# EasyEDA Pro project ProDoc_眼部光源板.epro

# Schematic Schematic4
Board Name: 红外补光灯-眼部4; Create Date: 2026-01-05; Page Name: P1; Project Name: FAICAL TRACKER VR模块; Schematic Name: Schematic3_3; Update Date: 2026-01-06; BladeWidth: 10; Company: 嘉立创EDA; Page Size: A4; RegionStart: 1; ShowBorder: 1; TitleBlock: 1; TitleBlockPosition: 3; Version: V1.0; XRegionCount: 6; YRegionCount: 4
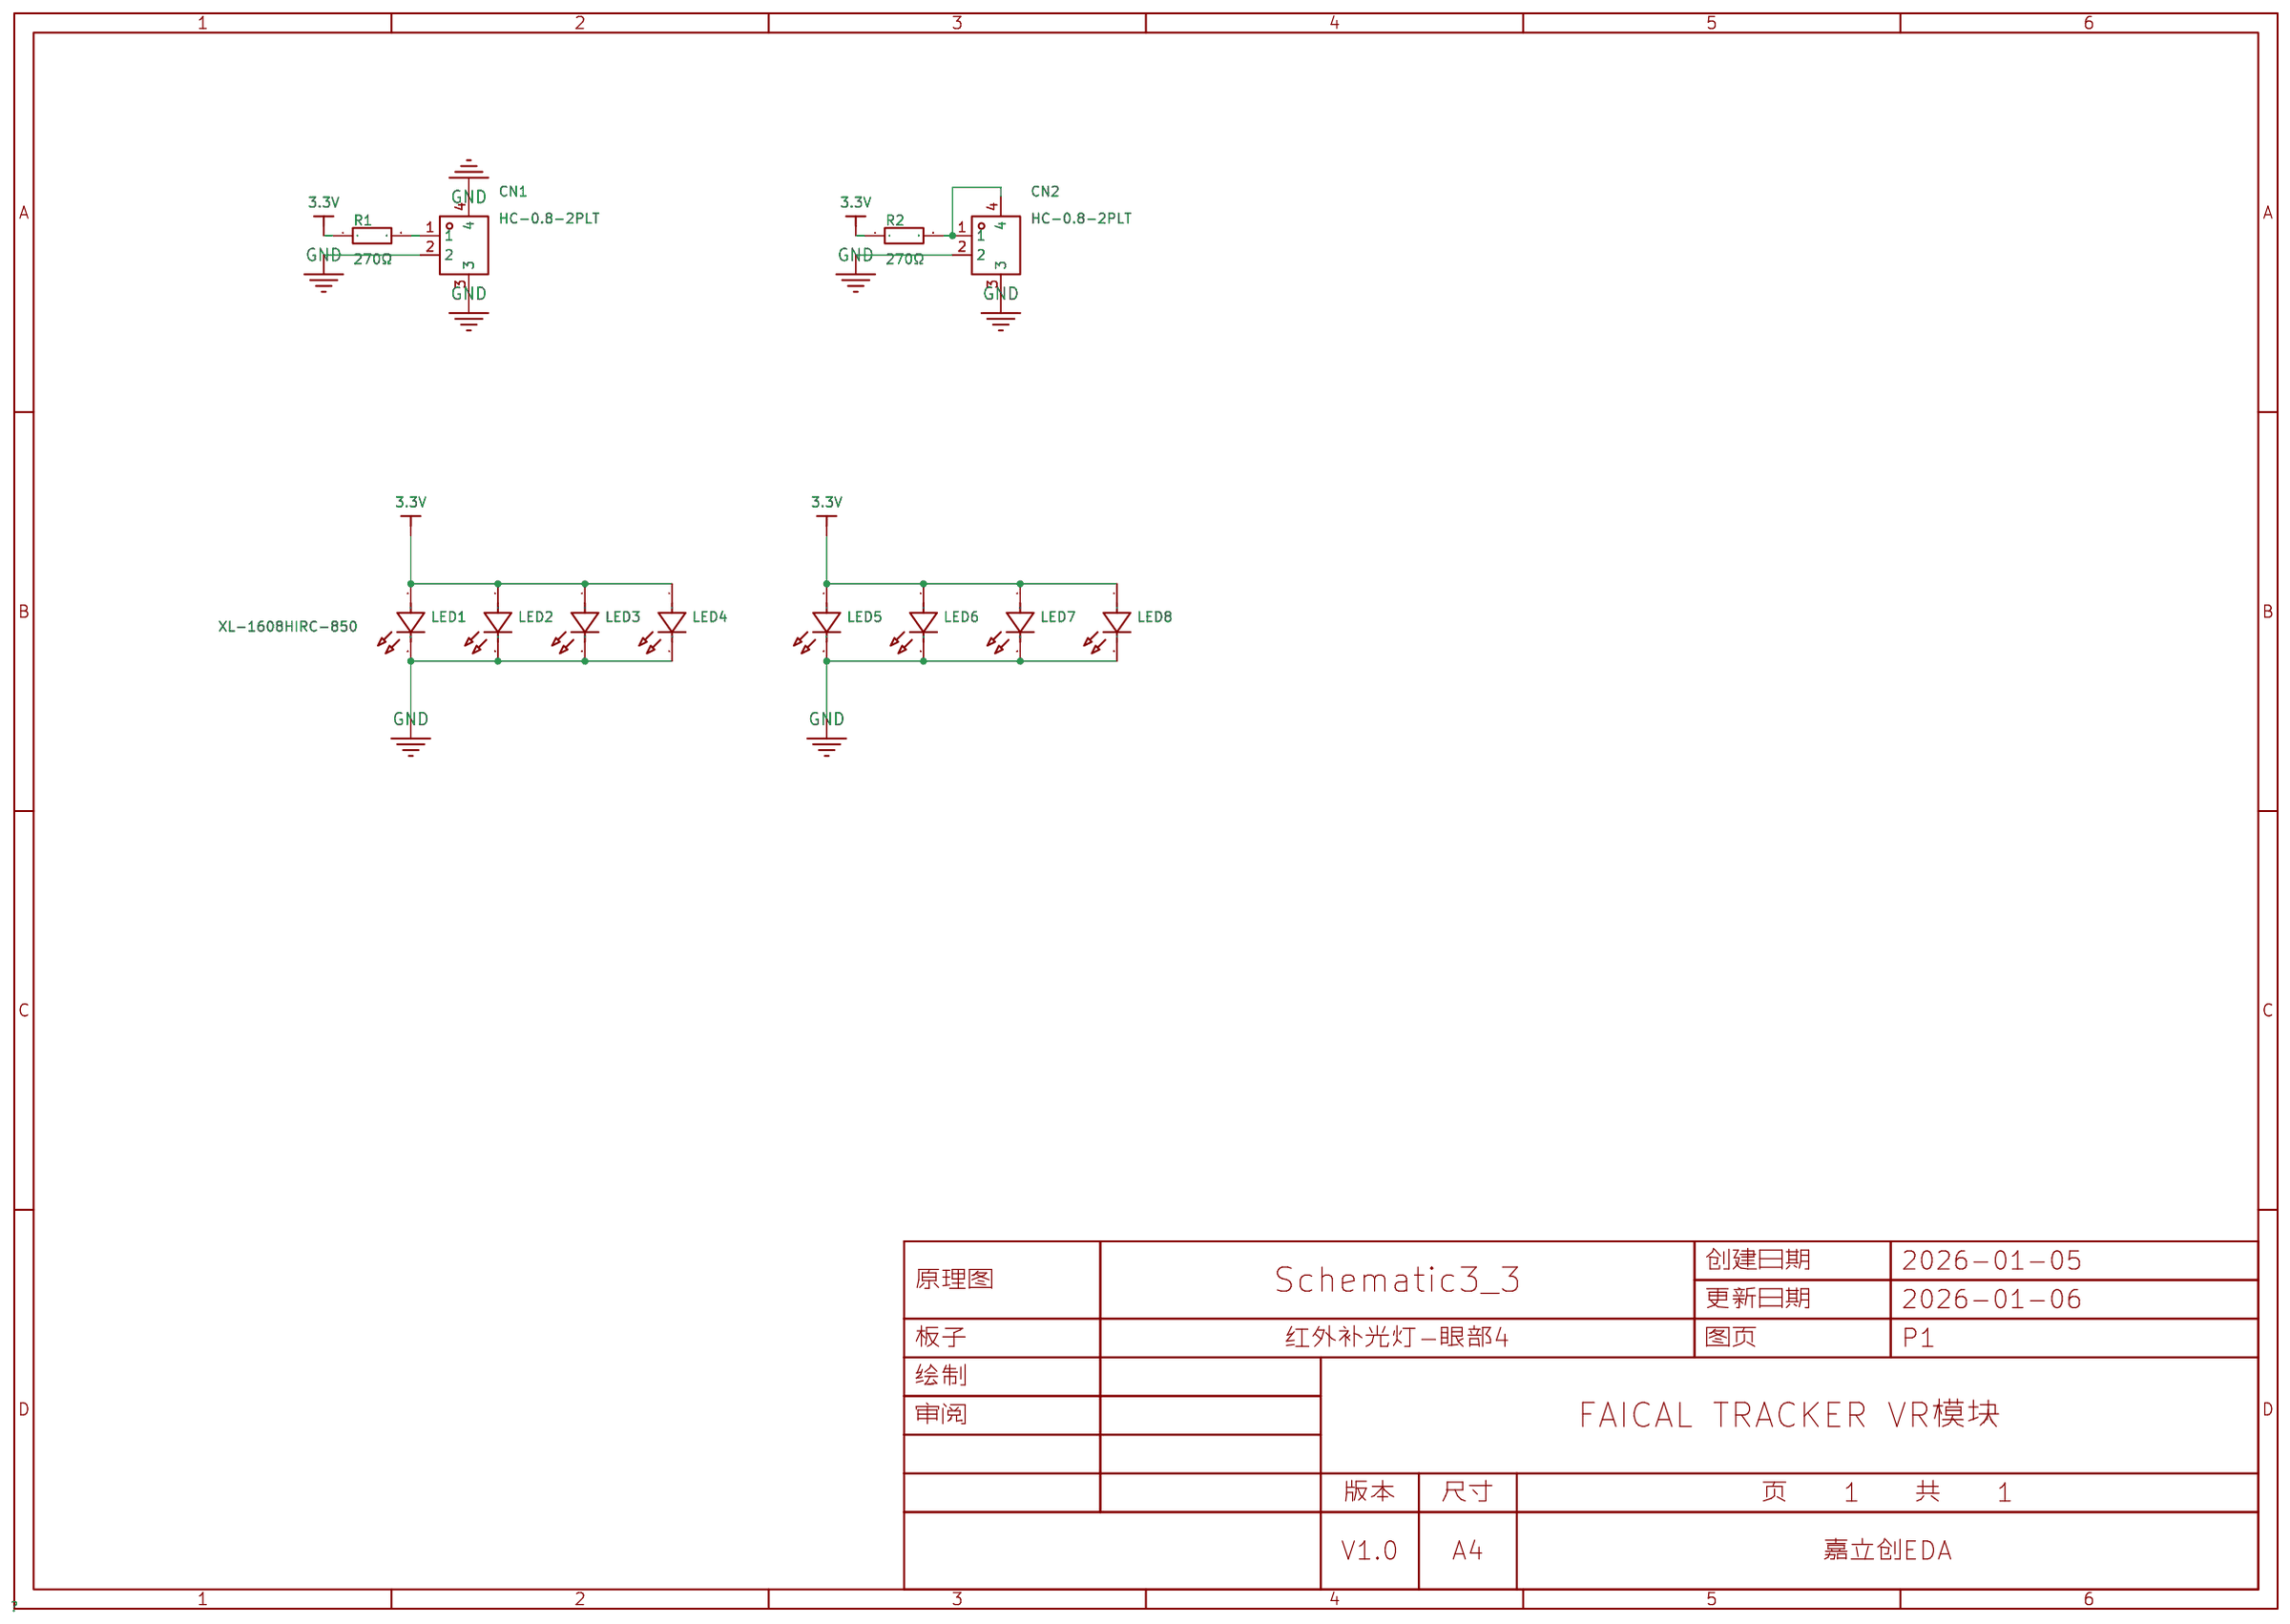
[diagram p0: schematic sheet]

## Parts
CN1  HC-0.8-2PLT  [CONN-SMD_2P-P0.80_HCTL_HC-0.8-2PLT]
CN2  HC-0.8-2PLT  [CONN-SMD_2P-P0.80_HCTL_HC-0.8-2PLT]
LED1  XL-1608HIRC-850  [OPTO-SMD_L1.6-W0.80-RD_XL-1608HIRC-850]
LED2  XL-1608HIRC-850  [OPTO-SMD_L1.6-W0.80-RD_XL-1608HIRC-850]
LED3  XL-1608HIRC-850  [OPTO-SMD_L1.6-W0.80-RD_XL-1608HIRC-850]
LED4  XL-1608HIRC-850  [OPTO-SMD_L1.6-W0.80-RD_XL-1608HIRC-850]
LED5  XL-1608HIRC-850  [OPTO-SMD_L1.6-W0.80-RD_XL-1608HIRC-850]
LED6  XL-1608HIRC-850  [OPTO-SMD_L1.6-W0.80-RD_XL-1608HIRC-850]
LED7  XL-1608HIRC-850  [OPTO-SMD_L1.6-W0.80-RD_XL-1608HIRC-850]
LED8  XL-1608HIRC-850  [OPTO-SMD_L1.6-W0.80-RD_XL-1608HIRC-850]
R1  270Ω  [R0603]
R2  270Ω  [R0603]

## Library data of the parts
CN1 CN2 = HC-0.8-2PLT: 插针结构:1x2P;间距:0.8mm;安装方式:立贴;参考系列:-;总PIN数:2P;排数:1;每排PIN数:2;行距:-;额定电流:500mA;触头材质:磷青铜;触头镀层:锡;工作温度范围:-25℃~+85℃;; LCSC Part Name: 1x2P 间距:0.8mm 立贴; Supplier Part: C2845352; Manufacturer: HCTL(华灿天禄); Supplier Footprint: SMD,P=0.8mm; JLCPCB Part Class: 扩展库; Datasheet: https://atta.szlcsc.com/upload/public/pdf/source/20230707/E6027C9B14B825F412DA71DD45B27639.pdf; Supplier: LCSC; Pins Structure: 1x2P; Pitch: 0.8mm; Mounting Style: 立贴; Number of Pins: 2P; Number of Rows: 1; Number of PINs Per Row: 2; Current Rating (Max): 500mA; Contact Material: 磷青铜; Contact Plating: 锡; Operating Temperature Range: -25℃~+85℃; Rated Voltage (Max): 30V; Plastic Material: LCP; Flame Retardant Rating: UL94V-0; Supplementary Features: 辅助焊脚; Z-Height of the Board: 2.8mm; X-Length of Bottom Edge on Board (Spacing Line): 3.8mm; Y-Width of Bottom Edge on Board: 2.15mm
LED1-LED8 = XL-1608HIRC-850: 正向电压:1.3V~1.7V;耗散功率:70mW;波长:850nm~860nm;辐射强度:-;正向电流-DC (If):30mA;直流反向耐压:5V;视角:120°;; LCSC Part Name: 850nm 30mA红外发射; Supplier Part: C965885; Manufacturer: XINGLIGHT(成兴光); Supplier Footprint: 0603; JLCPCB Part Class: Extended Part; Datasheet: https://atta.szlcsc.com/upload/public/pdf/source/20221102/BD31B8549814085368CE28C247371275.pdf; Supplier: LCSC; Vf - Forward Voltage: 1.3V~1.7V; Power Dissipation: 70mW; Wavelength: 850nm~860nm; Current - DC Forward (If): 30mA; Reverse Voltage: 5V; View Angle: 120°; Operating Temperature: -30℃~+85℃
R1 R2 = 0603WAF2700T5E: 电阻类型:厚膜电阻;阻值:270Ω;精度:±1%;功率:100mW;工作电压:75V;温度系数:±100ppm/℃;; LCSC Part Name: 270Ω ±1% 100mW 厚膜电阻; Supplier Part: C22966; Manufacturer: UNI-ROYAL(厚声); Supplier Footprint: 0603; JLCPCB Part Class: Basic Part; Datasheet: https://item.szlcsc.com/datasheet/0603WAF2700T5E/23693.html; Supplier: LCSC; Type: 厚膜电阻; Tolerance: ±1%; Power(Watts): 100mW; Voltage-Supply(Max): 75V; Temperature Coefficient: ±100ppm/℃; Operating Temperature: -55℃~+155℃

## Nets
3.3V: LED1.1(A) LED2.1(A) LED3.1(A) LED4.1(A) LED5.1(A) LED6.1(A) LED7.1(A) LED8.1(A) R1.1 R2.1
GND: CN1.2 CN1.3 CN1.4 CN2.2 CN2.3 LED1.2(C) LED2.2(C) LED3.2(C) LED4.2(C) LED5.2(C) LED6.2(C) LED7.2(C) LED8.2(C)
$1N2966: CN1.1 R1.2
$1N6073: CN2.1 CN2.4 R2.2

# Board PCB4
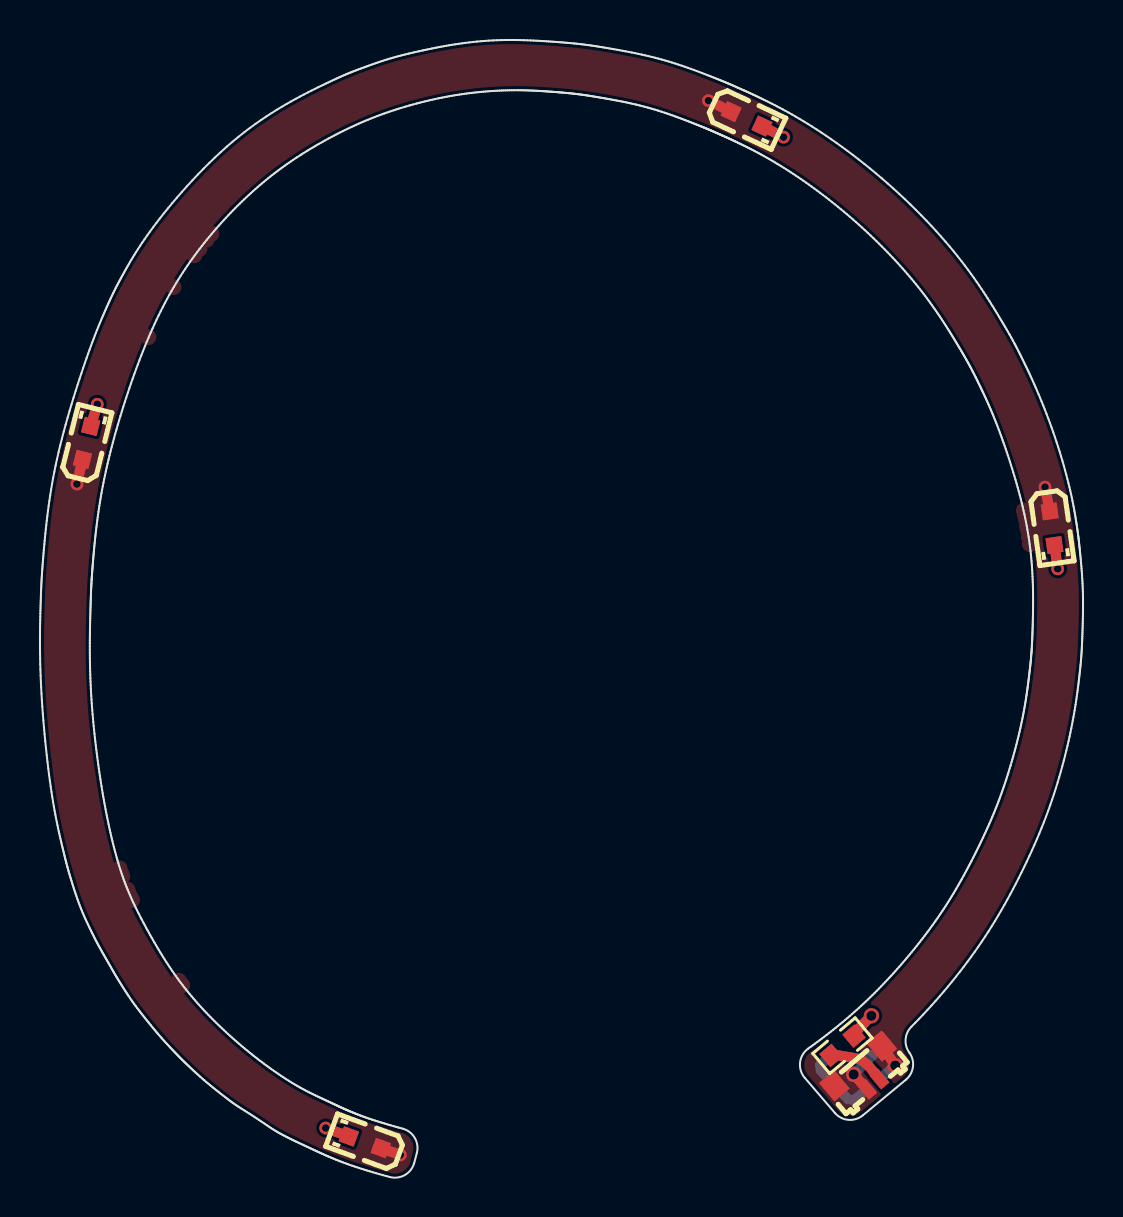
[diagram p1: board, top side]
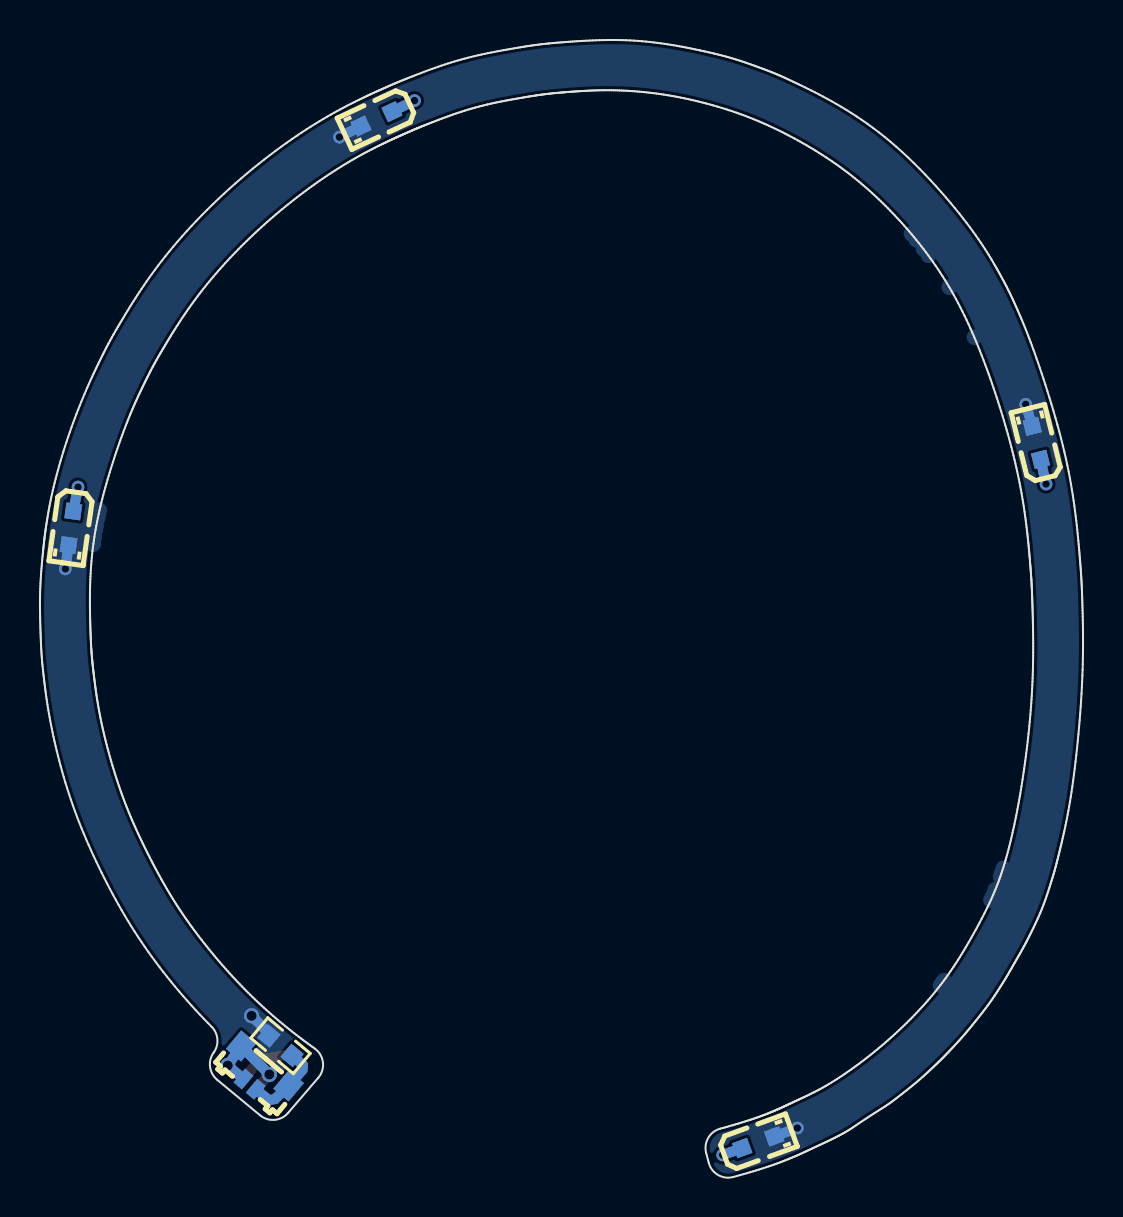
[diagram p2: board, bottom side, seen from below]

Outline 52.19 x 56.86 mm; copper layers: Top Layer, Bottom Layer. Coordinates in mm from the lower left corner of the outline.
Stack: Top Layer 0.035mm / SUBSTRATE1 0.71mm FR4 er 4.5 / Bottom Layer 0.035mm

## Design rules (mm)
spacing copperThickness1oz (default): track to track 0.152, other pairs 0.152 to 0.3
spacing copperThickness2oz: track to track 0.203, other pairs 0.152 to 0.3
spacing Plane_innerPlane: track to track 0.152, other pairs 0.152 to 0.3
spacing Copper_copperRegion: track to track 0.152, other pairs 0.152 to 0.3
spacing Copper_copperRegion1: track to track 0.152, other pairs 0.152 to 0.3
track width copperThickness1oz (default): min 0.127, default 0.254, max 2.54
track width copperThickness2oz: min 0.203, default 0.254, max 2.54
differential pair differentialPair (default): width min 0.127, default 0.254, max 2.54; gap min 0.152, default 0.152
differential pair USB-90Ω: width min 0.157, default 0.157, max 0.157; gap min 0.203, default 0.203
net GND uses copperRegion1_copperThickness1oz
pour e64 uses Copper_copperRegion, copperRegion1_Copper_copperRegion
pour e61 uses Copper_copperRegion1, copperRegion1_Copper_copperRegion1

## Placement (name value [footprint] x y rotation side)
CN1  HC-0.8-2PLT  [CONN-SMD_2P-P0.80_HCTL_HC-0.8-2PLT]  41.35 5.07 220 top
CN2  HC-0.8-2PLT  [CONN-SMD_2P-P0.80_HCTL_HC-0.8-2PLT#2]  41.35 5.07 40 bottom
LED1  XL-1608HIRC-850  [OPTO-SMD_L1.6-W0.80-RD_XL-1608HIRC-850]  2.33 36.71 76 top
LED2  XL-1608HIRC-850  [OPTO-SMD_L1.6-W0.80-RD_XL-1608HIRC-850]  16.25 1.74 160 top
LED3  XL-1608HIRC-850  [OPTO-SMD_L1.6-W0.80-RD_XL-1608HIRC-850]  35.35 52.92 335 top
LED4  XL-1608HIRC-850  [OPTO-SMD_L1.6-W0.80-RD_XL-1608HIRC-850]  50.64 32.45 278 top
LED5  XL-1608HIRC-850  [OPTO-SMD_L1.6-W0.80-RD_XL-1608HIRC-850]  16.25 1.74 160 bottom
LED6  XL-1608HIRC-850  [OPTO-SMD_L1.6-W0.80-RD_XL-1608HIRC-850]  2.33 36.71 76 bottom
LED7  XL-1608HIRC-850  [OPTO-SMD_L1.6-W0.80-RD_XL-1608HIRC-850]  35.35 52.92 335 bottom
LED8  XL-1608HIRC-850  [OPTO-SMD_L1.6-W0.80-RD_XL-1608HIRC-850]  50.64 32.45 278 bottom
R1  270Ω  [R0603]  40.15 6.56 220 top
R2  270Ω  [R0603]  40.15 6.56 220 bottom

## Footprints (pads in the part's own frame, mm; a bottom-side part is the same pattern mirrored in y, then rotated)
CONN-SMD_2P-P0.80_HCTL_HC-0.8-2PLT
  rect 0.55x0.9 smd: 1(-0.4,0.55) 2(0.4,0.55)
  rect 1x1.2 smd: 3(1.55,-0.64) 4(-1.55,-0.64)
CONN-SMD_2P-P0.80_HCTL_HC-0.8-2PLT#2
  rect 0.55x0.9 smd: 1(-0.4,0.55) 2(0.4,0.55)
  rect 1x1.2 smd: 3(1.55,-0.64) 4(-1.55,-0.64)
OPTO-SMD_L1.6-W0.80-RD_XL-1608HIRC-850
  rect 0.8x0.8 smd: 1(0.851,0) 2(-0.851,0)
R0603
  rect 0.806x0.864 smd: 1(-0.753,0) 2(0.753,0)

## Nets
As in the schematic.

## Via types
v1: diameter 0.635, hole 0.381, Top Layer to Bottom Layer, 8 vias
v2: diameter 0.762, hole 0.508, Top Layer to Bottom Layer, 3 vias

## Routing (per net, layer and track width the routed paths; a pad name or vN(x,y) marks a point on that pad's centre or on a via; arc(x,y) is an arc through that point)
3.3V: length 12.2
  Top Layer w0.508: LED3.1 v1(37.21,52.01) ; v1(14.3,2.45) 15.45,2.03 ; LED1.1 v1(2.87,38.64) ; LED4.1 v1(50.92,30.42) ; 40.68,7.12 v2(41.6,8.06)
  Bottom Layer w0.508: 15.45,2.03 v1(14.3,2.45) ; LED3.1 v1(37.21,52.01) ; LED1.1 v1(2.87,38.64) ; LED4.1 v1(50.92,30.42) ; 40.68,7.12 v2(41.6,8.06)
GND: length 16
  Top Layer w0.508: 41.4,4.39 v2(40.71,5.13) ; LED2.2 v1(18.03,1.1) ; LED3.2 v1(33.45,53.83) ; v1(1.85,34.66) LED1.2 ; CN1.4 v2(42.8,5.57) ; LED4.2 v1(50.29,34.5)
  Bottom Layer w0.508: LED1.2 v1(1.85,34.66) ; LED3.2 v1(33.45,53.83) ; CN2.2 v2(42.8,5.57) CN1.4 v2(40.71,5.13) ; LED4.2 v1(50.29,34.5) ; LED2.2 v1(18.03,1.1)
$1N2966: length 2.9
  Top Layer w0.508: 39.53,6.16 41.02,5.9 41.42,5.6 CN1.1
$1N6073: length 4.1
  Bottom Layer w0.508: 41.4,4.39 40.74,3.85 40.43,3.9 CN2.4 39.06,5.34 39.04,5.6 39.58,6.08

## Copper pours and planes (outline as drawn; the poured copper is in the pictures)
3.3V on Bottom Layer: -0.74,56.91 54.35,56.91 54.35,-1.11 -0.74,-1.11
GND on Top Layer: -1.32,57.44 53.92,57.44 53.92,-0.7 -1.32,-0.7
